# EAGLE design Tricorder-BoosterPack (EAGLE 7.2.0)
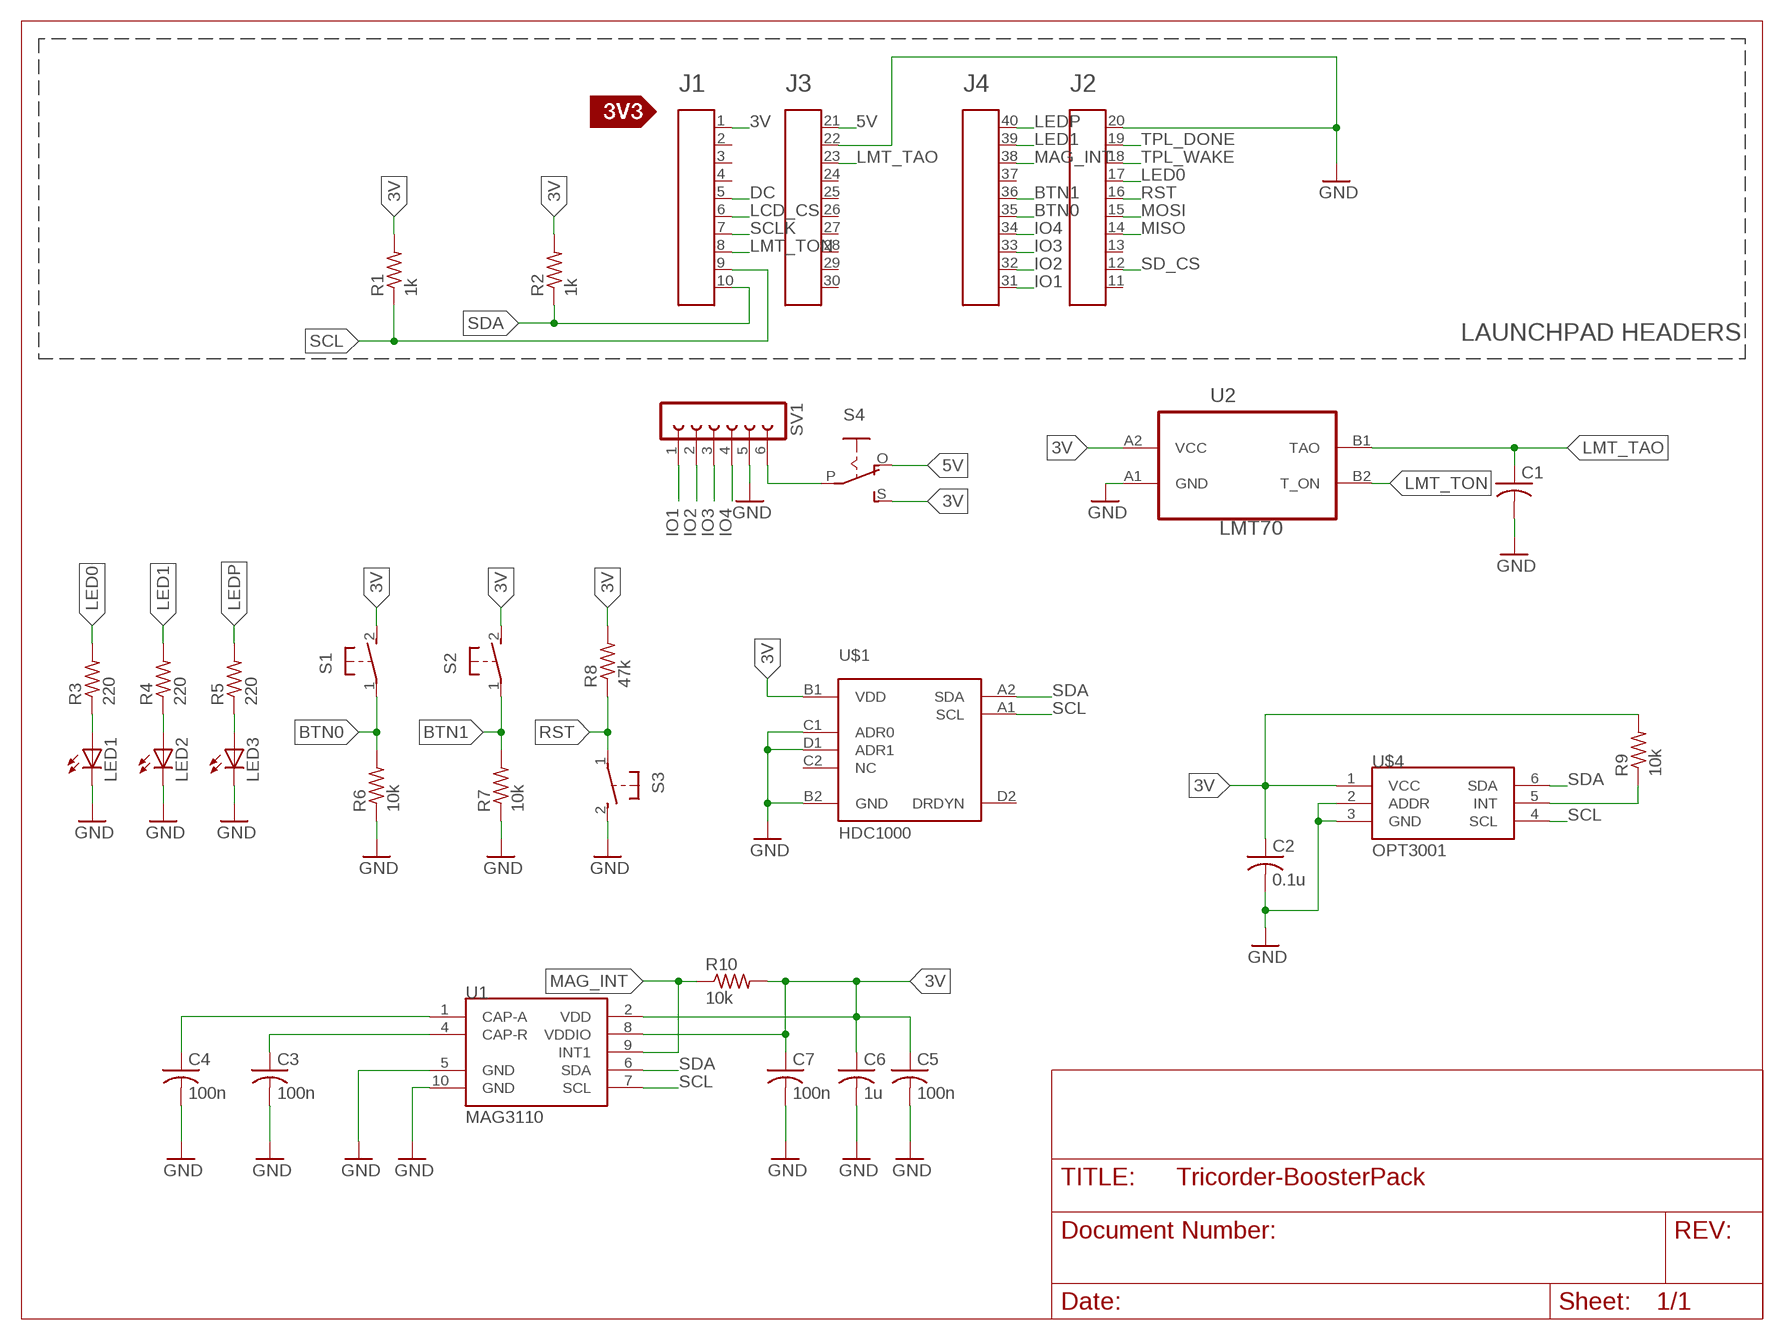
[diagram p0: schematic, sheet 1]

## Parts
A1  HEADER4X10-BOOSTERPACK  [4X10-BOOSTERPACK]
C1  C-USC0603  [C0603]
C2  0.1u  C-USC0603  [C0603]
C3  100n  C-USC0603  [C0603]
C4  100n  C-USC0603  [C0603]
C5  100n  C-USC0603  [C0603]
C6  1u  C-USC0603  [C0603]
C7  100n  C-USC0603  [C0603]
LED1  LEDCHIPLED_0603  [CHIPLED_0603]
LED2  LEDCHIPLED_0603  [CHIPLED_0603]
LED3  LEDCHIPLED_0603  [CHIPLED_0603]
R1  1k  R-US_R0603  [R0603]
R2  1k  R-US_R0603  [R0603]
R3  220  R-US_R0603  [R0603]
R4  220  R-US_R0603  [R0603]
R5  220  R-US_R0603  [R0603]
R6  10k  R-US_R0603  [R0603]
R7  10k  R-US_R0603  [R0603]
R8  47k  R-US_R0603  [R0603]
R9  10k  R-US_R0603  [R0603]
R10  10k  R-US_R0603  [R0603]
S1  31-XX  [B3F-31XX]
S2  31-XX  [B3F-31XX]
S3  31-XX  [B3F-31XX]
S4  EG1218S  [EG1218]
SV1  FE06-1  [FE06]
U1  MAG3110  [DFN-10]
U2  LMT70LMT70  [BGA4C40P2X2_77X77X50]
U$1  HDC1000  [DSBGA_8_YPA]
U$3  SILK_3V3_TAG  [SILK_3V3_TAG]
U$4  OPT3001  [SOT23-6]

## Nets
3V: A1.1 C2.1 R1.2 R2.2 R8.2 R9.2 S1.2(S) S2.2(S) S4.S U$1.B1(VDD) U$4.1(VCC)
5V: A1.21 S4.O
BTN0: A1.35 R6.2 S1.1(P)
BTN1: A1.36 R7.2 S2.1(P)
DC: A1.5
GND: A1.20 A1.22 C1.2 C2.2 C3.2 C4.2 C5.2 C6.2 C7.2 LED1.C LED2.C LED3.C R6.1 R7.1 S3.2(S) SV1.5 U1.5(GND) U1.10(GND) U2.A1(GND) U$1.B2(GND) U$1.C1(ADR0) U$1.D1(ADR1) U$4.2(ADDR) U$4.3(GND)
IO1: A1.31 SV1.1
IO2: A1.32 SV1.2
IO3: A1.33 SV1.3
IO4: A1.34 SV1.4
LCD_CS: A1.6
LED0: A1.17 R3.2
LED1: A1.39 R4.2
LEDP: A1.40 R5.2
LMT_TAO: A1.23 C1.1 U2.B1(TAO)
LMT_TON: A1.8 U2.B2(T_ON)
MAG_INT: A1.38 R10.1 U1.9(INT1)
MISO: A1.14
MOSI: A1.15
N$1: LED1.A R3.1
N$2: LED2.A R4.1
N$3: LED3.A R5.1
N$4: S4.P SV1.6
N$5: R9.1 U$4.5(INT)
N$6: U2.A2(VCC)
N$8: C3.1 U1.4(CAP-R)
N$9: C4.1 U1.1(CAP-A)
N$11: C5.1 C6.1 C7.1 R10.2 U1.2(VDD) U1.8(VDDIO)
RST: A1.16 R8.1 S3.1(P)
SCL: A1.9 R1.1 U1.7(SCL) U$1.A1(SCL) U$4.4(SCL)
SCLK: A1.7
SD_CS: A1.12
SDA: A1.10 R2.1 U1.6(SDA) U$1.A2(SDA) U$4.6(SDA)
TPL_DONE: A1.19
TPL_WAKE: A1.18
Unconnected: A1.2 A1.3 A1.4 A1.11 A1.13 A1.24 A1.25 A1.26 A1.27 A1.28 A1.29 A1.30 A1.37 U$1.C2(NC) U$1.D2(DRDYN)

## Notes on the sheet
- LAUNCHPAD HEADERS

## Library data of the parts
A1 = Public_BP_Library:HEADER4X10-BOOSTERPACK
C1-C7 = adafruit:C-US: CAPACITOR, American symbol
LED1-LED3 = adafruit:LED: LED OSRAM: - CHIPLED LG R971, LG N971, LY N971, LG Q971, LY Q971, LO R971, LY R971 LH N974, LH R974 LS Q976, LO Q976, LY Q976 LO Q996 - Hyper CHIPLED LW Q18S LB Q993, LB Q99A, LB R99A - SideLED LS A670, LO A670, LY A670, LG A670, LP A670 LB A673, LV A673, LT A673, LW A673 LH A674 LY A675 LS A676, LA A676, LO A676, LY A676, LW A676 LS A679, LY A679, LG A679 - Hyper Micro SIDELED® LS Y876, LA Y876, LO Y876, LY Y876 LT Y87S - SmartLED LW L88C, LW L88S LB L89C, LB L89S, LG L890 LS L89K, LO L89K, LY L89K LS L896, LA L896, LO L896, LY L896 - TOPLED LS T670, LO T670, LY T670, LG T670, LP T670 LSG T670, LSP T670, LSY T670, LOP T670, LYG T670 LG T671, LOG T671, LSG T671 LB T673, LV T673, LT T673, LW T673 LH T674 LS T676, LA T676, LO T676, LY T676, LB T676, LH T676, LSB T676, LW T676 LB T67C, LV T67C, LT T67C, LS T67K, LO T67K, LY T67K, LW E67C LS E67B, LA E67B, LO E67B, LY E67B, LB E67C, LV E67C, LT E67C LW T67C LS T679, LY T679, LG T679 LS T770, LO T770, LY T770, LG T770, LP T770 LB T773, LV T773, LT T773, LW T773 LH T774 LS E675, LA E675, LY E675, LS T675 LS T776, LA T776, LO T776, LY T776, LB T776 LHGB T686 LT T68C, LB T68C - Hyper Mini TOPLED® LB M676 - Mini TOPLED Santana® LG M470 LS M47K, LO M47K, LY M47K Source: http://www.osram.convergy.de/
R1-R10 = resistor:R-US_: RESISTOR, American symbol
S1-S3 = adafruit:31-XX: OMRON SWITCH Now with beefier pads!
S4 = adafruit:EG1218: SLIDING SWITCH 0.1" spacing through hole, vertical SPDT slide switch http://www.ladyada.net/library/pcb/eaglelibrary.html
SV1 = con-lsta:FE06-1: FEMALE HEADER; OC_FARNELL: unknown; OC_NEWARK: unknown
U1 = SparkFun-Sensors:MAG3110: 3-axis digital (I2C) magnetometer
U2 = LMT70:LMT70: LOW-POWER SINGLE INVERTER GATE; MPN: LMT70; OC_FARNELL: -; OC_NEWARK: 50R7866; PACKAGE: BGA-4; SUPPLIER: Texas Instruments
U$1 = Fra:HDC1000
U$3 = Public_BP_Library:SILK_3V3_TAG
U$4 = OPT3001:OPT3001

## Net classes
0 default: width 0.254 mm, drill 0.508 mm

## Board
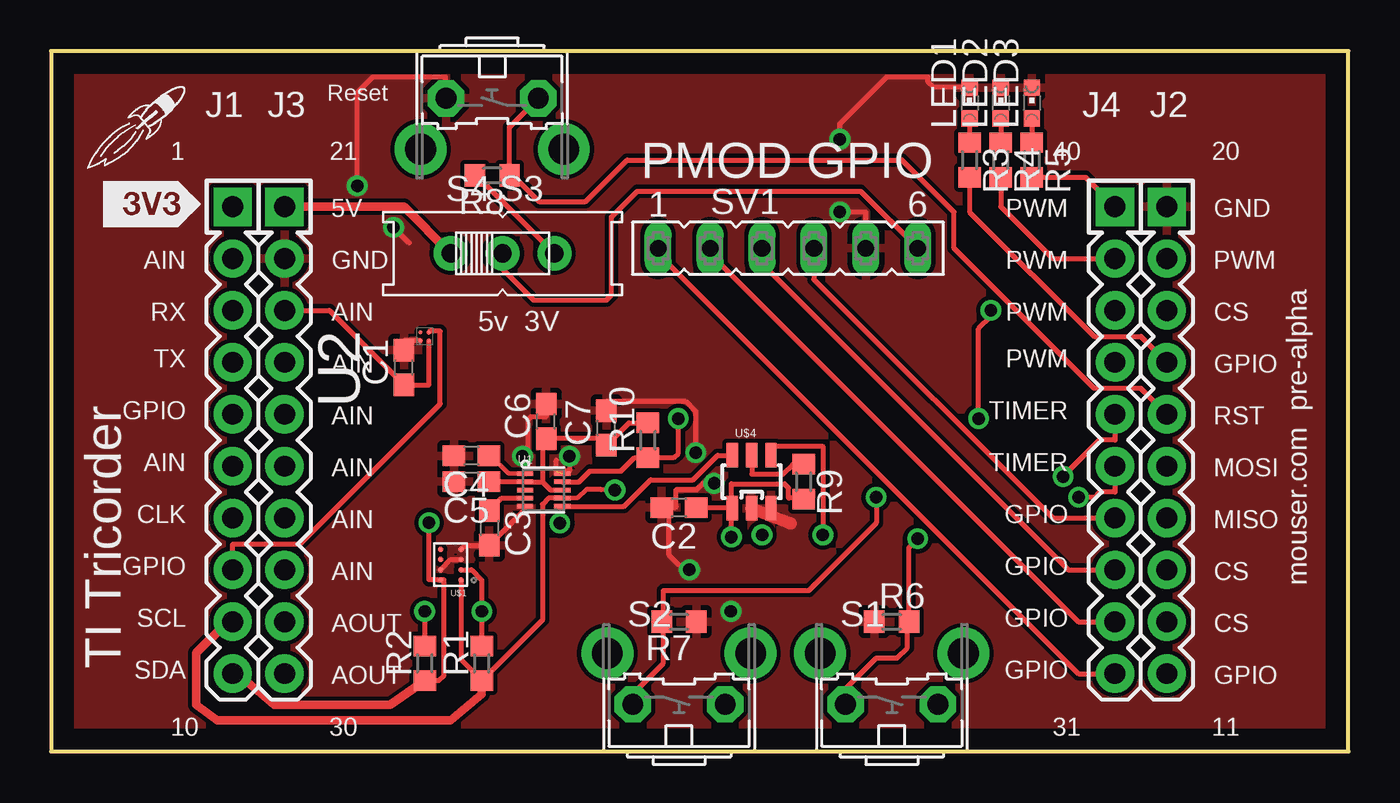
[diagram p1: board, top side]
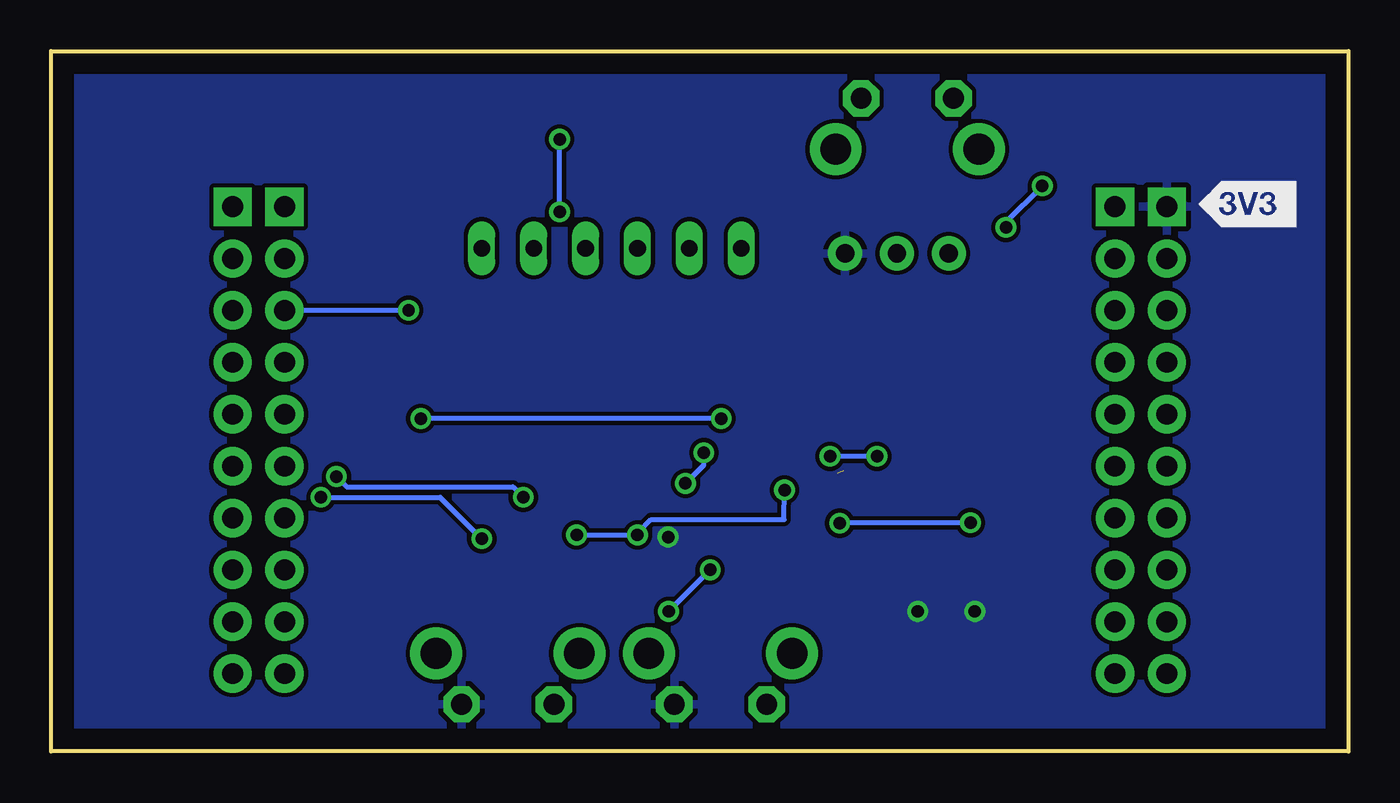
[diagram p2: board, bottom side, seen from below]

Size 63.5 x 34.29 mm. Coordinates in mm from the lower left corner, seen from the top.
Outline: 0,0 63.5,0 63.5,34.29 0,34.29 0,0
Copper layers (1*16): Top 0.035mm / dielectric 1.5mm / Bottom 0.035mm
Design rules "default": minimum track width 10mil, minimum drill 24mil, track to track 8mil, track to pad 8mil, pad to pad 8mil, via to via 8mil, smd to smd 8mil, copper to edge 40mil, drill to drill 8mil, minimum pad ring 10mil, minimum via ring 8mil, stop-mask expansion 4mil, vias tented up to drill 0mil, thermal gap 10mil

### Footprints (pad centres in the part's own frame; a part is rotated, then mirrored left to right if it is on the bottom)
4X10-BOOSTERPACK = drill 1.016 pad 1.88 square: 1 0,10.16; 20 45.72,10.16; 21 2.54,10.16; 40 43.18,10.16 | drill 1.016 pad 1.88: 2 0,7.62; 3 0,5.08; 4 0,2.54; 5 0,0; 6 0,-2.54; 7 0,-5.08; 8 0,-7.62; 9 0,-10.16; 10 0,-12.7; 11 45.72,-12.7; 12 45.72,-10.16; 13 45.72,-7.62; 14 45.72,-5.08; 15 45.72,-2.54; 16 45.72,0; 17 45.72,2.54; 18 45.72,5.08; 19 45.72,7.62; 22 2.54,7.62; 23 2.54,5.08; 24 2.54,2.54; 25 2.54,0; 26 2.54,-2.54; 27 2.54,-5.08; 28 2.54,-7.62; 29 2.54,-10.16; 30 2.54,-12.7; 31 43.18,-12.7; 32 43.18,-10.16; 33 43.18,-7.62; 34 43.18,-5.08; 35 43.18,-2.54; 36 43.18,0; 37 43.18,2.54; 38 43.18,5.08; 39 43.18,7.62
C0603 = smd 1.1 x 1: 1 -0.85,0; 2 0.85,0
CHIPLED_0603 = smd 0.8 x 0.8: A 0,-0.75; C 0,0.75
R0603 = smd 1 x 1.1: 1 -0.85,0; 2 0.85,0
B3F-31XX = drill 1.016 pad 1.778 octagon: 1 -2.261,-1.245; 2 2.261,-1.245 | drill 1.499 pad 2.54: 3 -3.505,1.245; 4 3.505,1.245
EG1218 = drill 0.9 pad 1.676: O -2.54,0; P 0,0; S 2.54,0
FE06 = drill 0.813 long: 1 -6.35,0; 2 -3.81,0; 3 -1.27,0; 4 1.27,0; 5 3.81,0; 6 6.35,0
DFN-10 = smd 0.8 x 0.22: 1 -0.91,0.8; 2 -0.91,0.4; 3 -0.91,0; 4 -0.91,-0.4; 5 -0.91,-0.8; 6 0.91,-0.8; 7 0.91,-0.4; 8 0.91,0; 9 0.91,0.4; 10 0.91,0.8
BGA4C40P2X2_77X77X50 = smd 0.203 x 0.203: A1 -0.203,0.203; A2 0.203,0.203; B1 -0.203,-0.203; B2 0.203,-0.203
DSBGA_8_YPA = smd 0.275 x 0.275: A1 -0.5,0.75; A2 0.5,0.75; B1 -0.5,0.25; B2 0.5,0.25; C1 -0.5,-0.25; C2 0.5,-0.25; D1 -0.5,-0.75; D2 0.5,-0.75
SOT23-6 = smd 0.55 x 1.2: 1 -0.95,-1.3; 2 0,-1.3; 3 0.95,-1.3; 4 0.95,1.3; 5 0,1.3; 6 -0.95,1.3

### Placement (x,y rotation side)
A1  8.89,16.51 0 top
C1  17.27,18.8 90 top
C2  30.73,11.94 180 top
C3  21.45,10.94 270 top
C4  20.57,14.48 180 top
C5  20.57,13.21 180 top
C6  24.23,16.16 90 top
C7  27.18,15.84 90 top
LED1  44.96,31.75 0 top
LED2  46.48,31.75 0 top
LED3  48.01,31.75 0 top
R1  21.08,4.32 90 top
R2  18.29,4.32 90 top
R3  44.96,28.96 270 top
R4  46.48,28.96 270 top
R5  48.01,28.96 270 top
R6  41.15,6.35 0 top
R7  30.73,6.35 180 top
R8  21.59,28.19 180 top
R9  36.83,13.21 270 top
R10  29.21,15.24 90 top
S1  41.15,3.56 0 top
S2  30.73,3.56 0 top
S3  21.59,30.73 180 top
S4  22.1,24.38 0 top
SV1  36.07,24.64 0 top
U1  24.11,12.8 0 top
U2  18.29,20.32 90 top
U$1  19.56,9.14 180 top
U$2  [LOGO-ROCKET]  4.32,30.73 0 top
U$3  2.54,25.65 0 top
U$4  34.29,13.21 0 top

### Tracks (layer width: path | path; a pad name or v marks a point on that pad's centre or on a via)
3V  (via drill 0.61)
  Top 0.254: 21.08,5.08 R1.2 v21.08,6.86 21.08,8.38 20.57,8.89 U$1.B1 | S4.S 20.83,28.19 R8.2 | v18.29,6.86 R2.2 | 33.02,11.94 U$4.1 | 36.83,12.45 R9.2 36.8,12.4 36.1,12.4 36.1,12.9 35.9,13.1 33.3,13.1 33.3,12 U$4.1 | C2.1 33.31,11.94 U$4.1 | v33.3,10.5 33.3,11.8 U$4.1
  pour Bottom: -0.51,34.8 -0.51,-0.76 64.26,-0.76 64.26,34.8
5V
  Top 0.406: A1.21 17.27,26.67 S4.O
BTN0  (via drill 0.61)
  Top 0.254: S1.1 38.89,3.07 40.39,4.57 41.4,4.57 41.91,5.08 41.91,6.26 R6.2 42,9.99 v42.42,10.41 | v50.29,12.45 51.05,12.45 51.31,12.7 52.07,12.7 A1.35
  Bottom 0.254: v42.42,10.41 44.45,12.45 v50.29,12.45
BTN1  (via drill 0.61)
  Top 0.254: S2.1 28.47,2.82 29.97,4.32 29.97,6.26 R7.2 29.97,6.35 29.97,7.87 37.08,7.87 40.39,11.18 v40.39,12.45 | v49.53,13.46 51.31,15.24 52.07,15.24 A1.36
  Bottom 0.254: v40.39,12.45 40.89,12.95 49.02,12.95 v49.53,13.46
GND  (via drill 0.61)  (1 unrouted)
  Top 0.254: S3.2 19.3,32 19.3,33.02 15.75,33.02 14.99,32.26 v14.99,27.69 | 17.53,24.89 v16.76,25.65 | LED1.C 44.96,32.51 43.18,32.51 42.93,32.77 42.93,33.02 40.89,33.02 38.61,30.73 v38.61,29.97 | v38.61,26.42 39.88,26.42 SV1.5 | U2.A1 17.27,20.12 C1.2 | v31.24,8.89 31.24,8.64 30.23,9.65 30.23,11.68 | U$1.B2 19.56,9.39 U$1.C1 | v31.55,14.62 31.55,14.85 31.65,14.95 31.55,15.05 31.55,16.65 31.05,17.15 27.18,17.15 C7.2 | v32.45,13.12 31.9,13.12 31.6,12.82 30.6,12.82 30.6,11.97 30.57,11.95 29.9,11.95 C2.2 29.95,11.9 | U$1.D1 20.25,10.09 C3.2 23.2,11.84 U1.5 | 24.73,14.25 24.73,13.72 25.38,13.72 v25.38,14.45 | v23.07,14.45 23.32,14.7 23.32,16.23 23.48,16.38 24.23,16.38 C6.2
  Top 0.61: U$4.2 36.2,11.18
  Bottom 0.254: v14.99,27.69 16.76,25.91 v16.76,25.65 | v38.61,26.42 v38.61,29.97 | v33.27,6.86 v31.24,8.89 | v31.55,14.62 31.55,14.03 v32.45,13.12 | v23.07,14.45 v25.38,14.45
  pour Top: -0.51,34.8 -0.51,-0.76 64.26,-0.76 64.26,34.8
IO1
  Top 0.254: SV1.1 29.72,24.38 50.29,3.81 A1.31
IO2
  Top 0.254: SV1.2 32.26,24.38 50.29,6.35 A1.32
IO3
  Top 0.254: SV1.3 34.8,23.88 49.78,8.89 A1.33
IO4
  Top 0.254: SV1.4 37.34,23.11 49.02,11.43 A1.34
LED0
  Top 0.254: R3.2 44.96,26.42 51.05,20.32 53.34,20.32 A1.17
LED1
  Top 0.254: R4.2 46.48,26.67 49.02,24.13 A1.39
LEDP
  Top 0.254: R5.2 50.63,28.11 A1.40
LMT_TAO
  Top 0.254: U2.B1 18.49,17.95 C1.1 13.63,21.59 A1.23
LMT_TON
  Top 0.254: A1.8 8.89,10.16 12.19,10.16 19.05,17.02 19.05,20.57 18.54,20.57 U2.B2
MAG_INT  (via drill 0.61)
  Top 0.254: v45.4,16.3 45.4,20.7 46,21.3 v46,21.6 | v30.7,16.3 30.7,14.6 30.5,14.4 29.3,14.4 R10.1 28.57,14.39 27.9,13.72 26.38,13.72 25.85,13.2 U1.9
  Bottom 0.254: v30.7,16.3 v45.4,16.3 | v46,21.6 52,21.6 A1.38
N$1
  Top 0.254: LED1.A R3.1
N$2
  Top 0.254: LED2.A R4.1
N$3
  Top 0.254: LED3.A R5.1
N$4
  Top 0.254: S4.P 22.1,23.62 23.62,22.1 27.18,22.1 27.43,22.35 27.43,26.16 28.7,27.43 39.62,27.43 SV1.6
N$5
  Top 0.254: 34.3,14.6 U$4.5 34.3,14.5 34.3,13.57 35.83,13.57 36.31,14.06 R9.1 36.9,14 37,14.1 36.9,14.2
N$8
  Top 0.254: C3.1 22.06,12.4 U1.4
N$9
  Top 0.22: C4.1 21.52,14.48 22.4,13.6 U1.1
N$11
  Top 0.254: C5.1 21.43,13.2 U1.2 24.05,13.2 | R10.2 28.28,16.09 C7.1 26.86,15.31 C6.1 24.05,15.13 24.05,13.2 | 24.05,13.2 24.45,12.8 U1.8
RST
  Top 0.254: S3.1 22.44,30.57 R8.1 22.61,28.19 23.88,26.92 26.16,26.92 28.19,28.96 41.66,28.96 44.2,26.42 44.2,24.64 51.05,17.78 53.34,17.78 A1.16
SCL  (via drill 0.61)
  Top 0.22: 26.2,12.82 25.77,12.4 U1.7
  Top 0.254: A1.9 8.64,6.35 | U$1.A1 20.06,4.49 R1.1 24.05,6.44 24.05,12.1 24.35,12.4 U1.7 | v37.77,10.6 37.77,14.93 37.75,14.95 35.25,14.95 35.25,14.53 U$4.4 | 26.2,12.82 26.93,12.82 v27.6,12.8
  Top 0.406: 8.64,6.35 7.11,4.83 7.11,2.29 8.13,1.52 19.56,1.52 21.08,2.79 R1.1
  Bottom 0.254: v37.77,10.6 v34.8,10.6 34.75,10.72 34.12,11.35 27.62,11.35 v27.6,12.8
SDA  (via drill 0.61)
  Top 0.254: A1.10 9.14,3.81 | U$4.6 32.62,14.5 31.43,13.3 29.35,13.3 28.05,12 U1.6 24.9,11.93 v24.9,11.18 | R2.1 18.5,3.5 18.5,3.48 18.98,3.48 19.23,3.73 19.23,8.4 19.07,8.4 U$1.A2 18.93,8.4 18.5,8.4 v18.5,11.2
  Top 0.406: 9.14,3.81 10.92,2.29 16.6,2.29 R2.1
  Bottom 0.254: v24.9,11.18 24.88,11.2 v18.5,11.2

### Text on the board
tPlace: Reset | PMOD GPIO | 5v 3V | mouser.com pre-alpha | TI Tricorder